# Altium schematic sheet 0255_GPU V1P8A POWER SW.SchDoc
size 848 x 558 mm
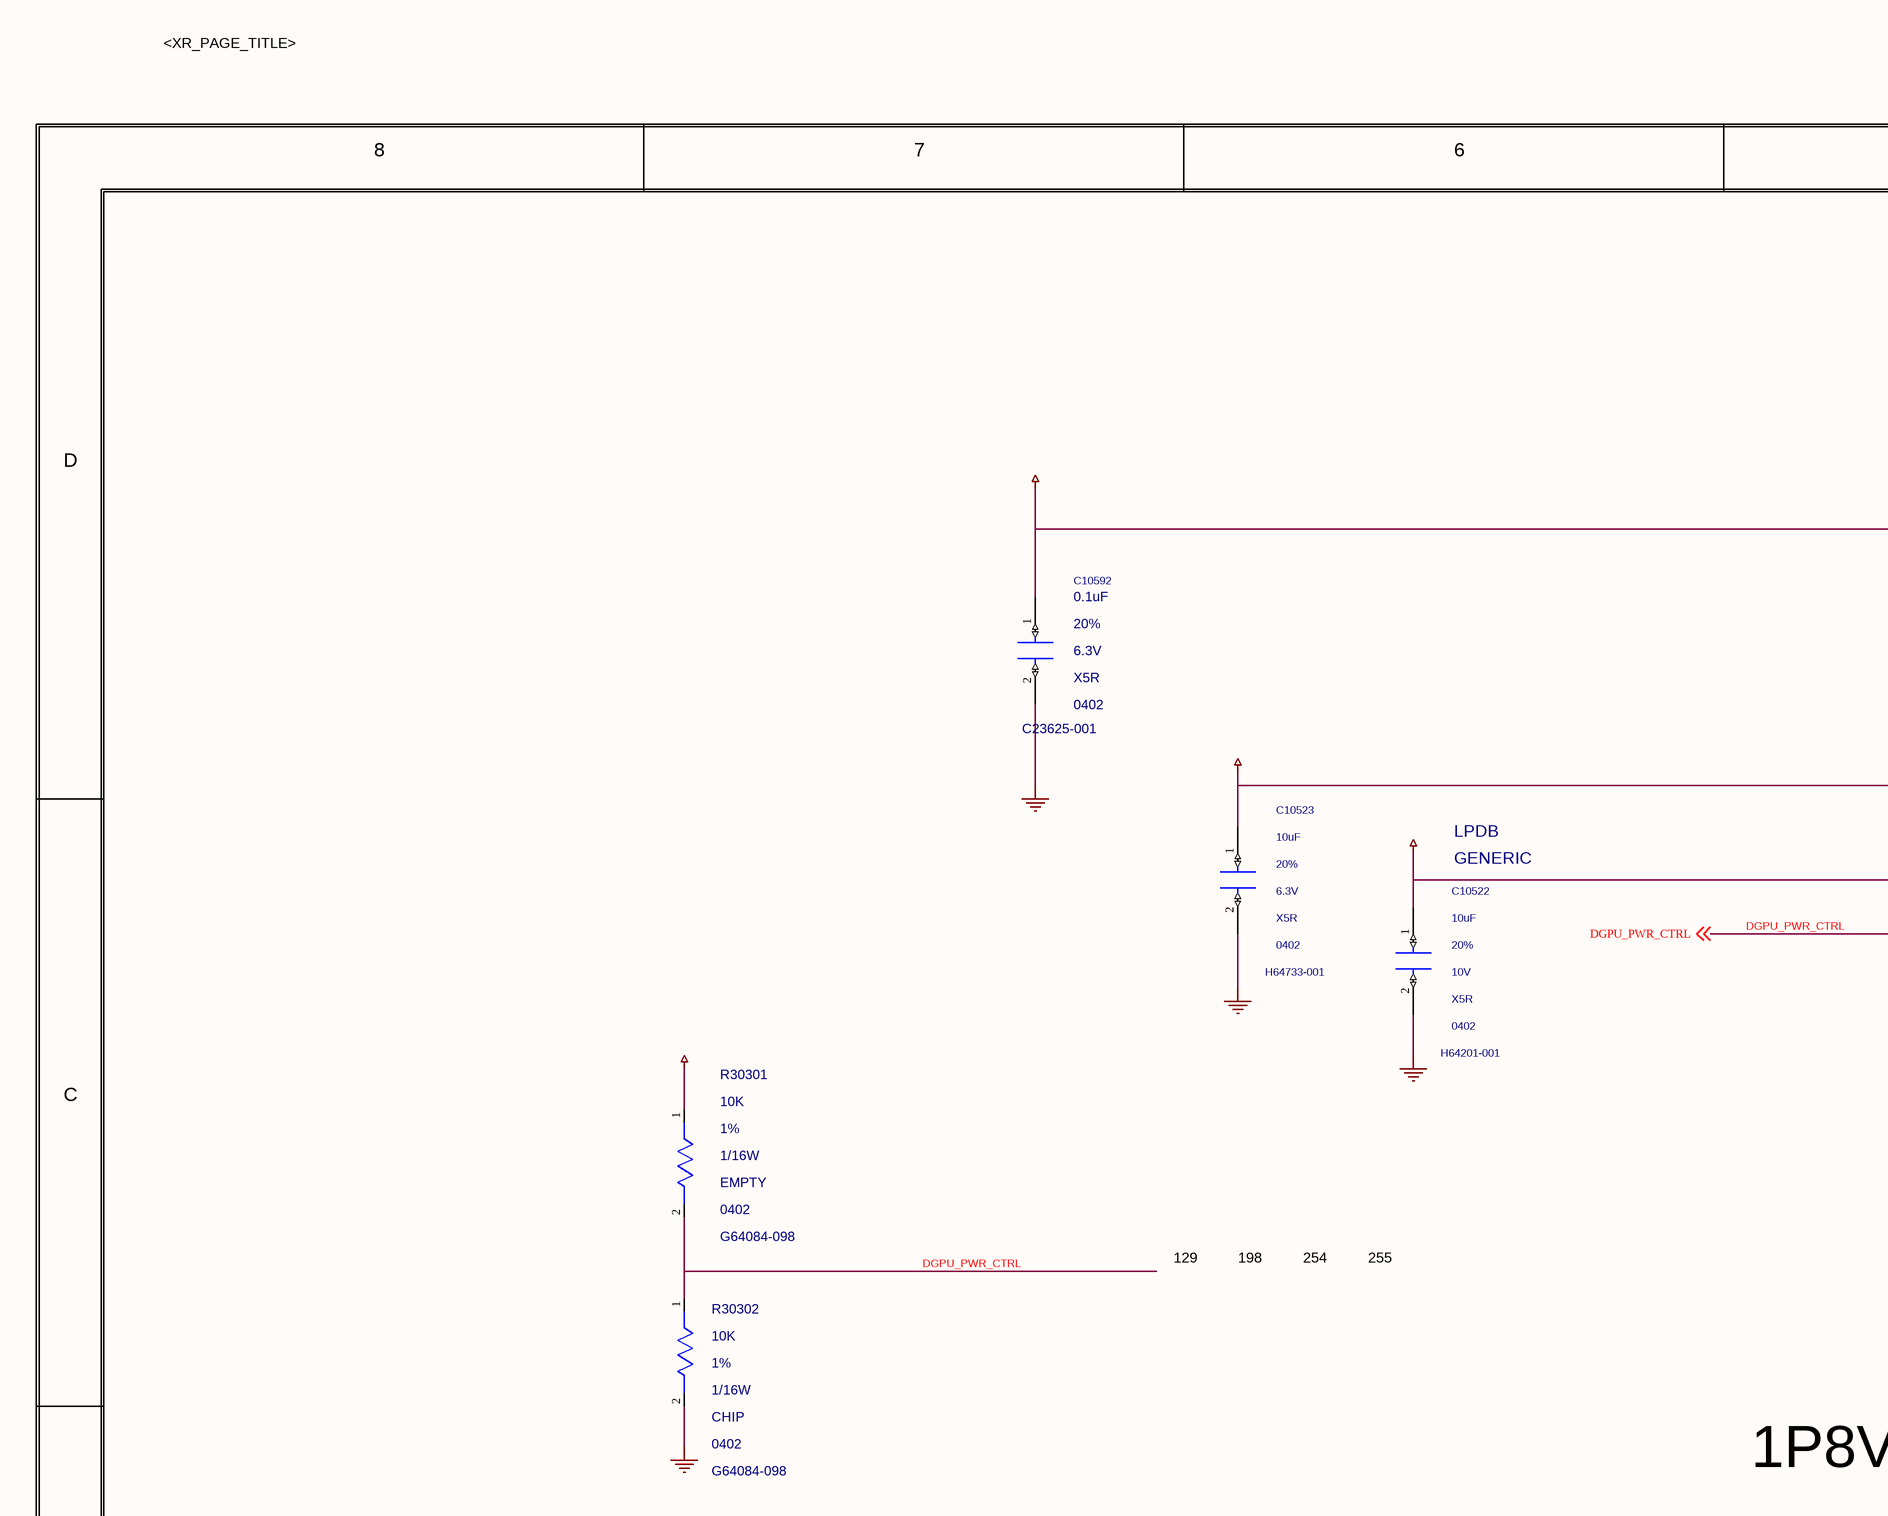
[diagram p0: 0255_GPU V1P8A POWER SW.SchDoc, top left]
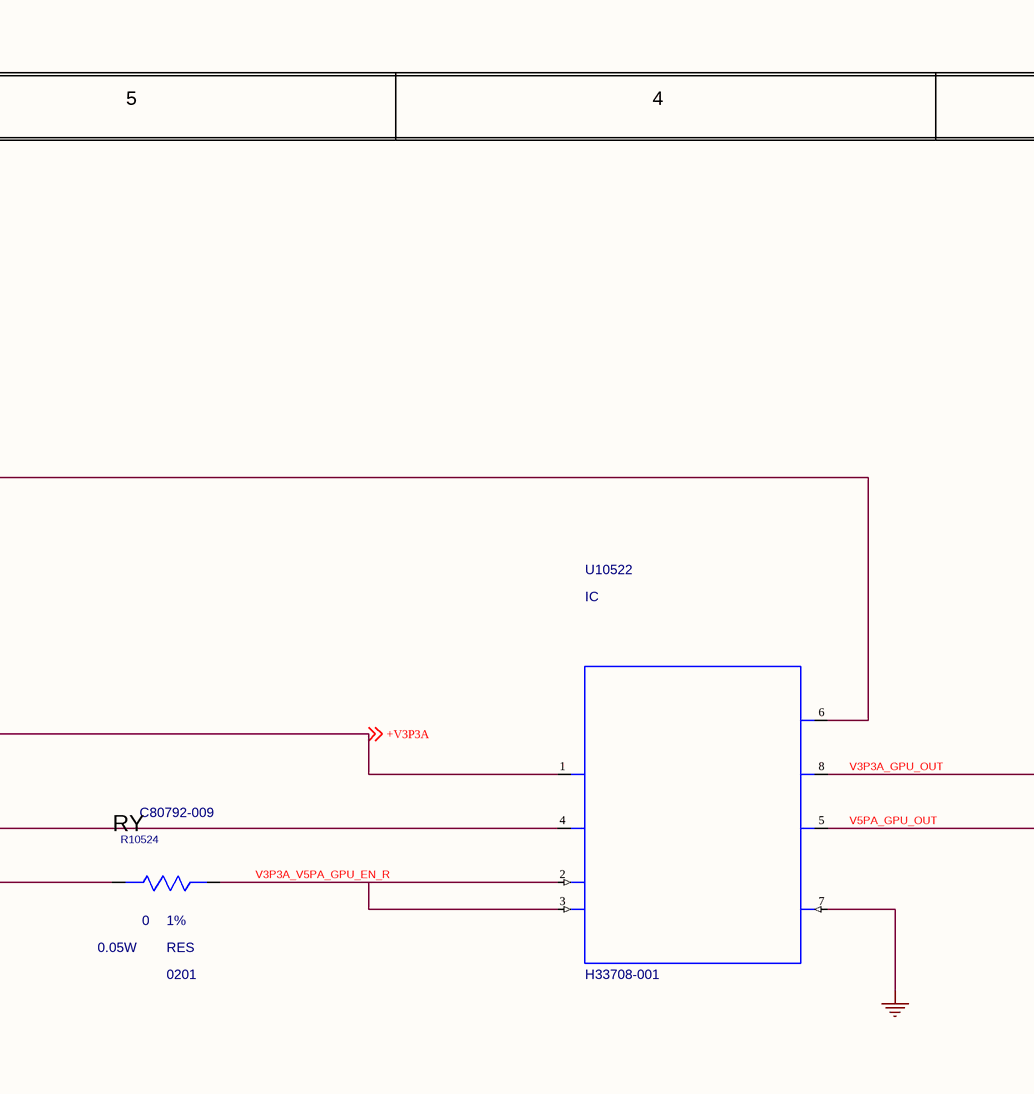
[diagram p1: 0255_GPU V1P8A POWER SW.SchDoc, top middle]
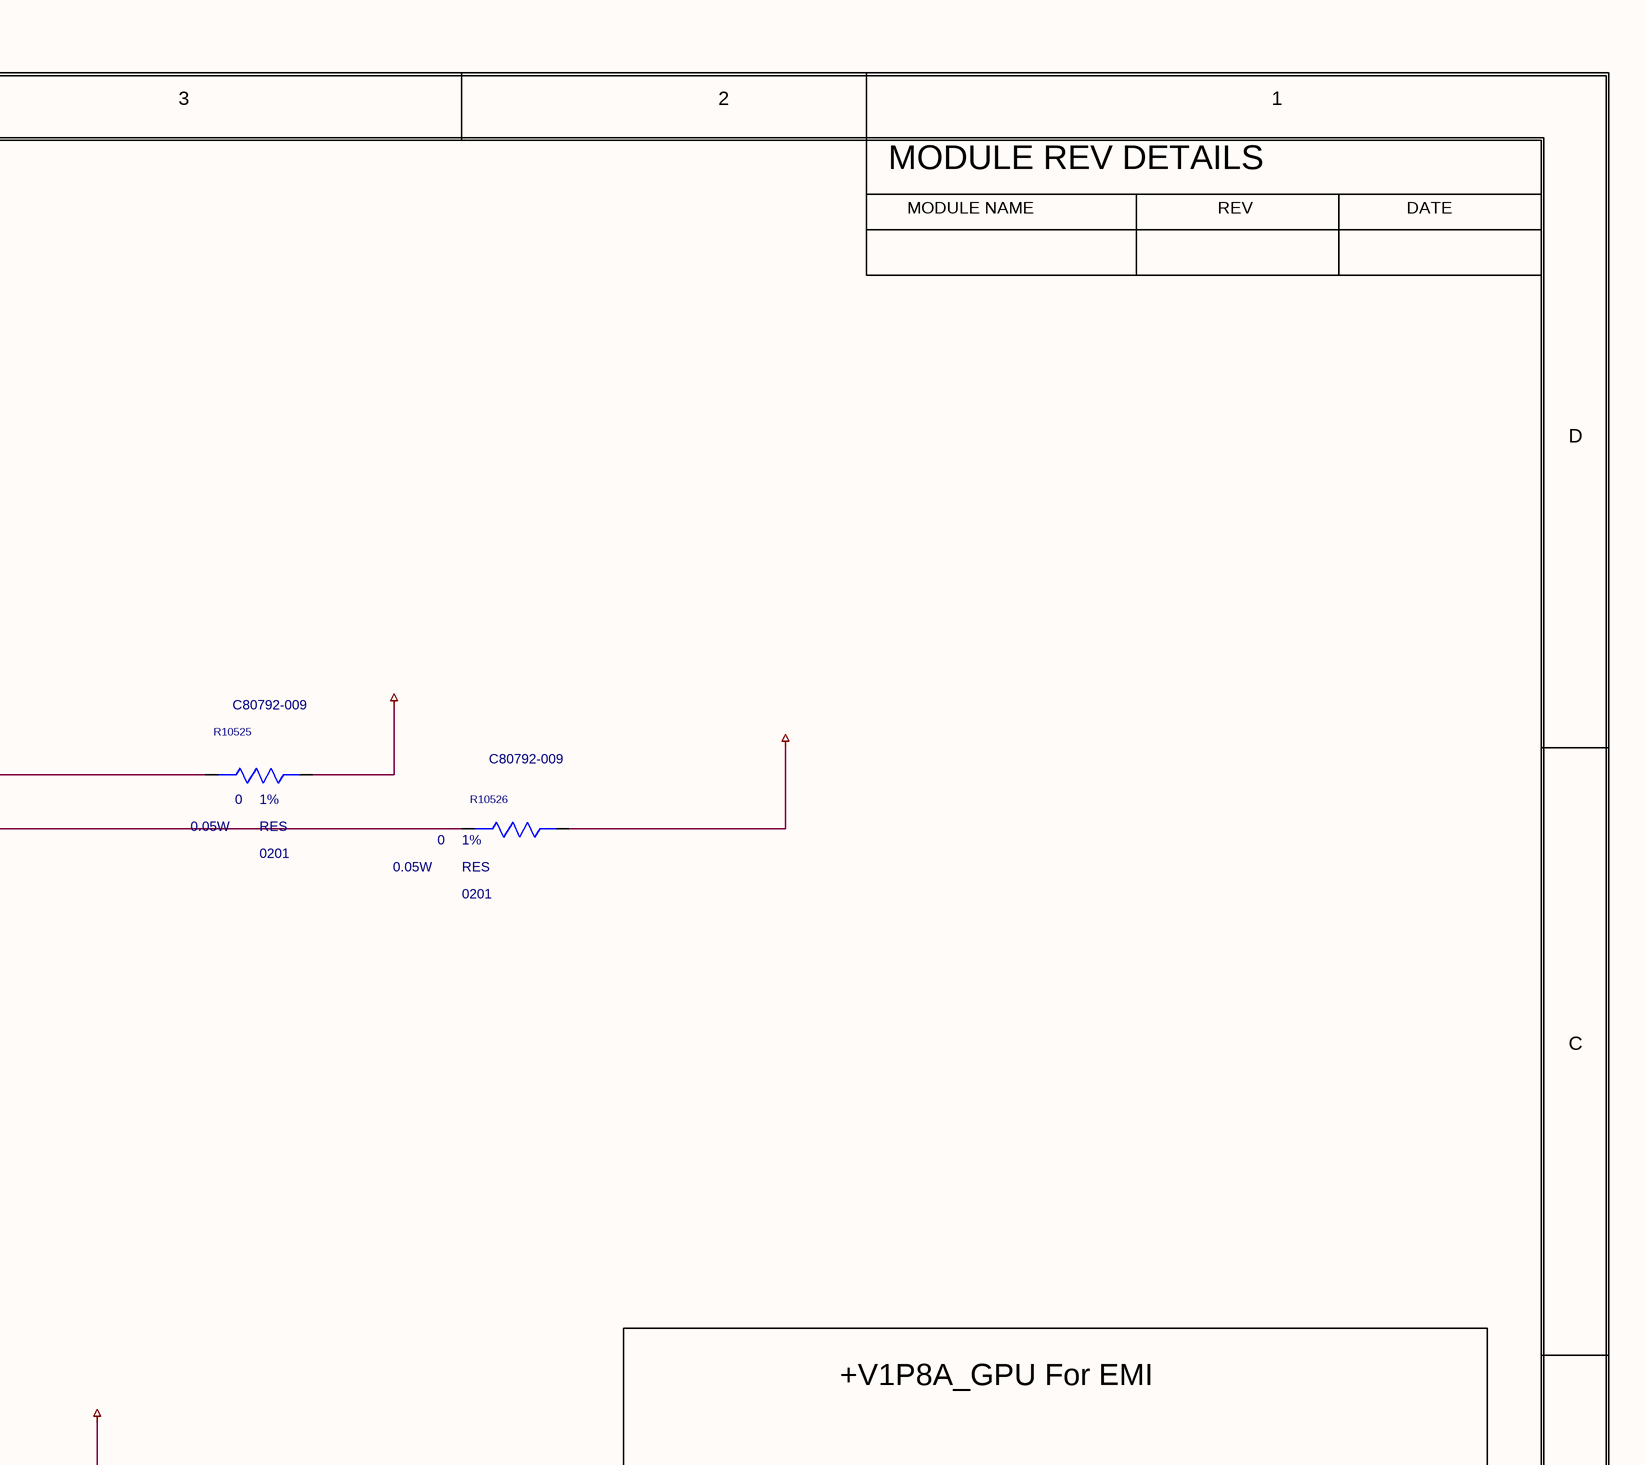
[diagram p2: 0255_GPU V1P8A POWER SW.SchDoc, top right]
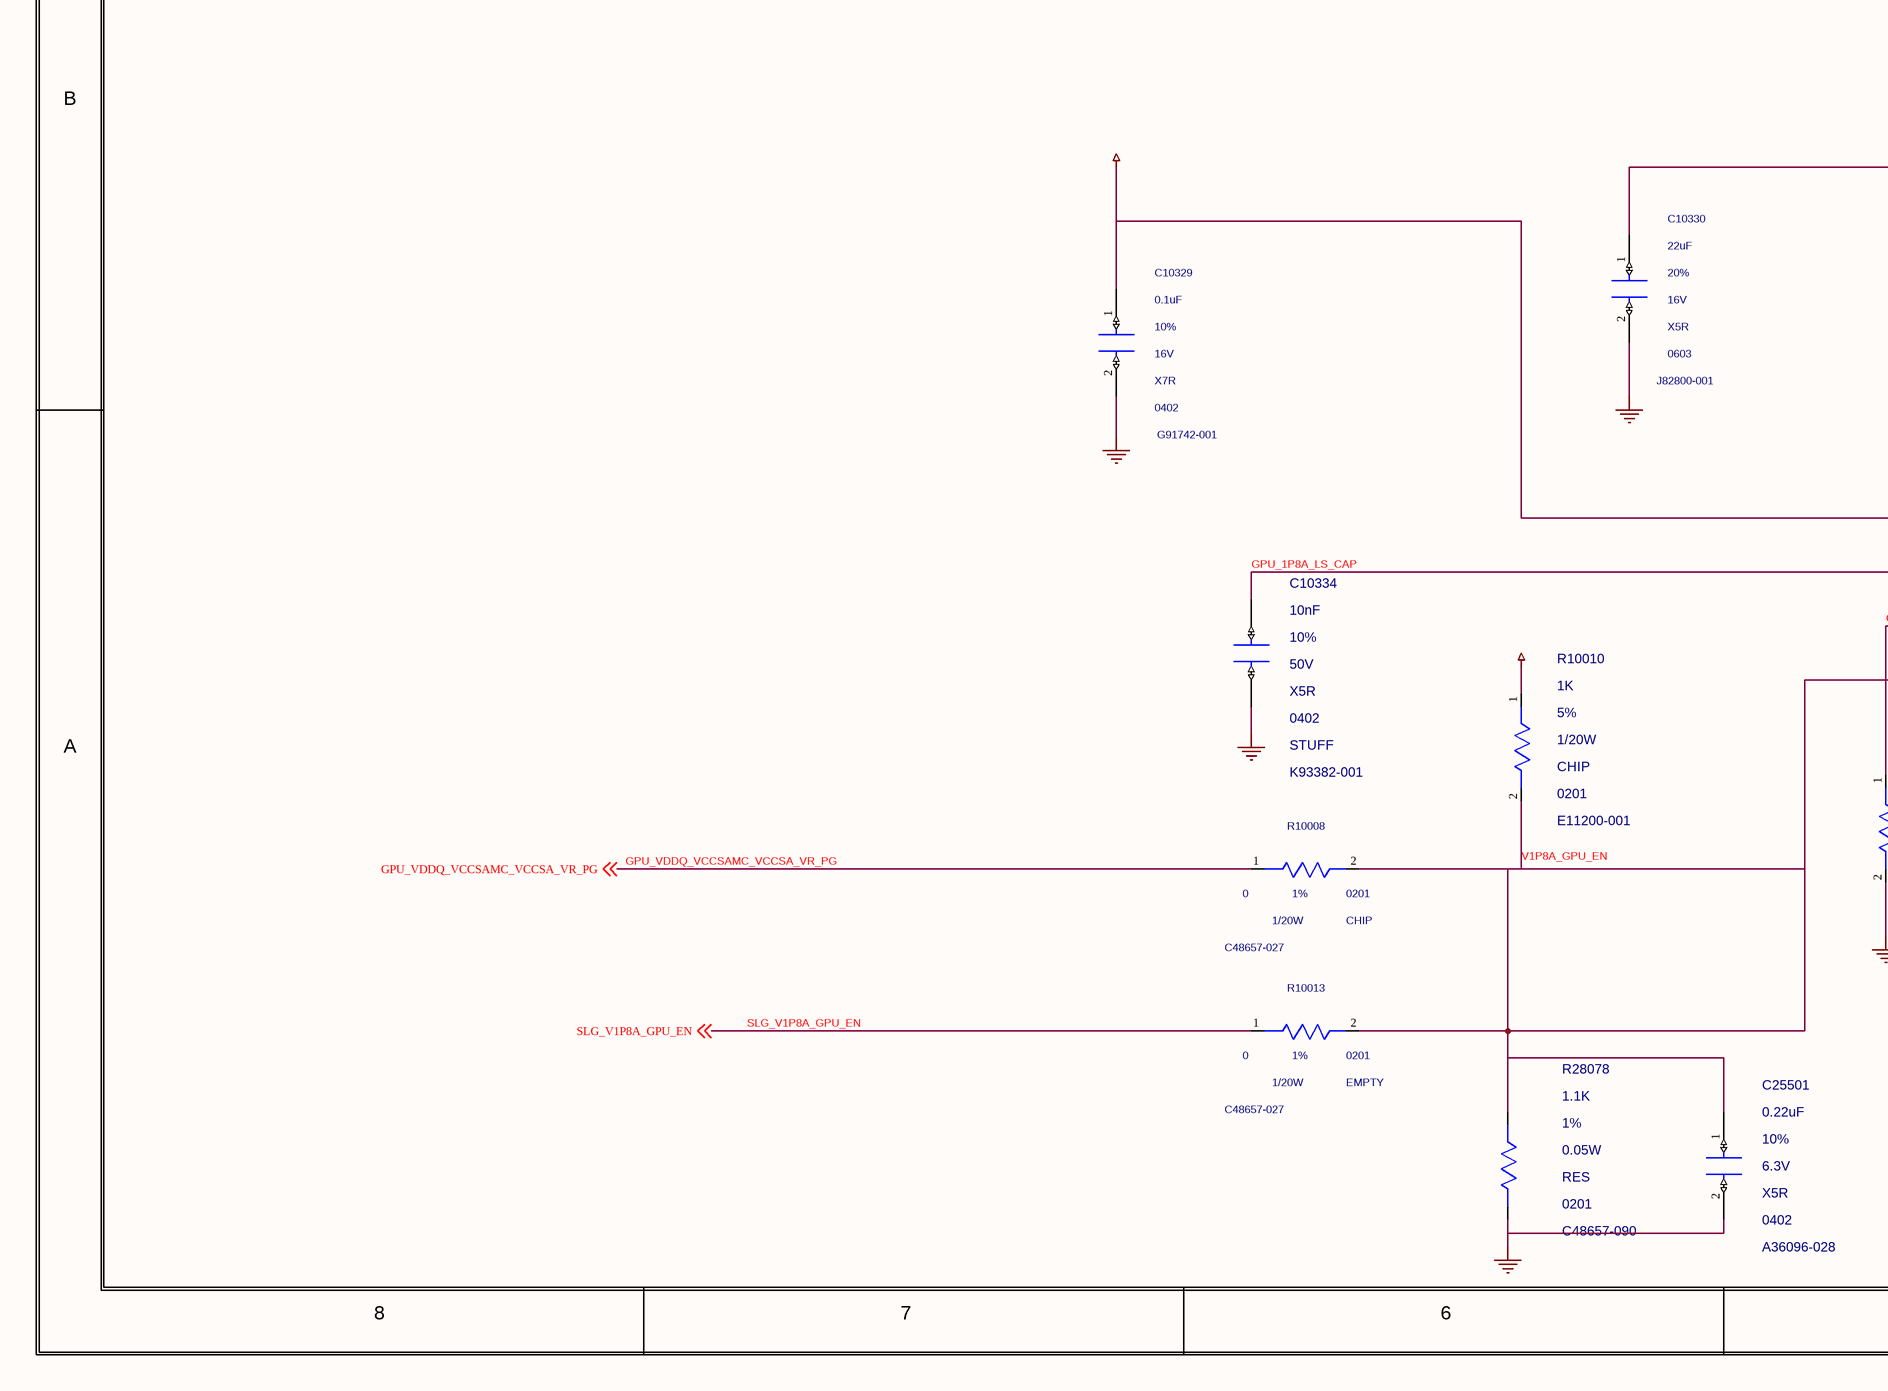
[diagram p3: 0255_GPU V1P8A POWER SW.SchDoc, bottom left]
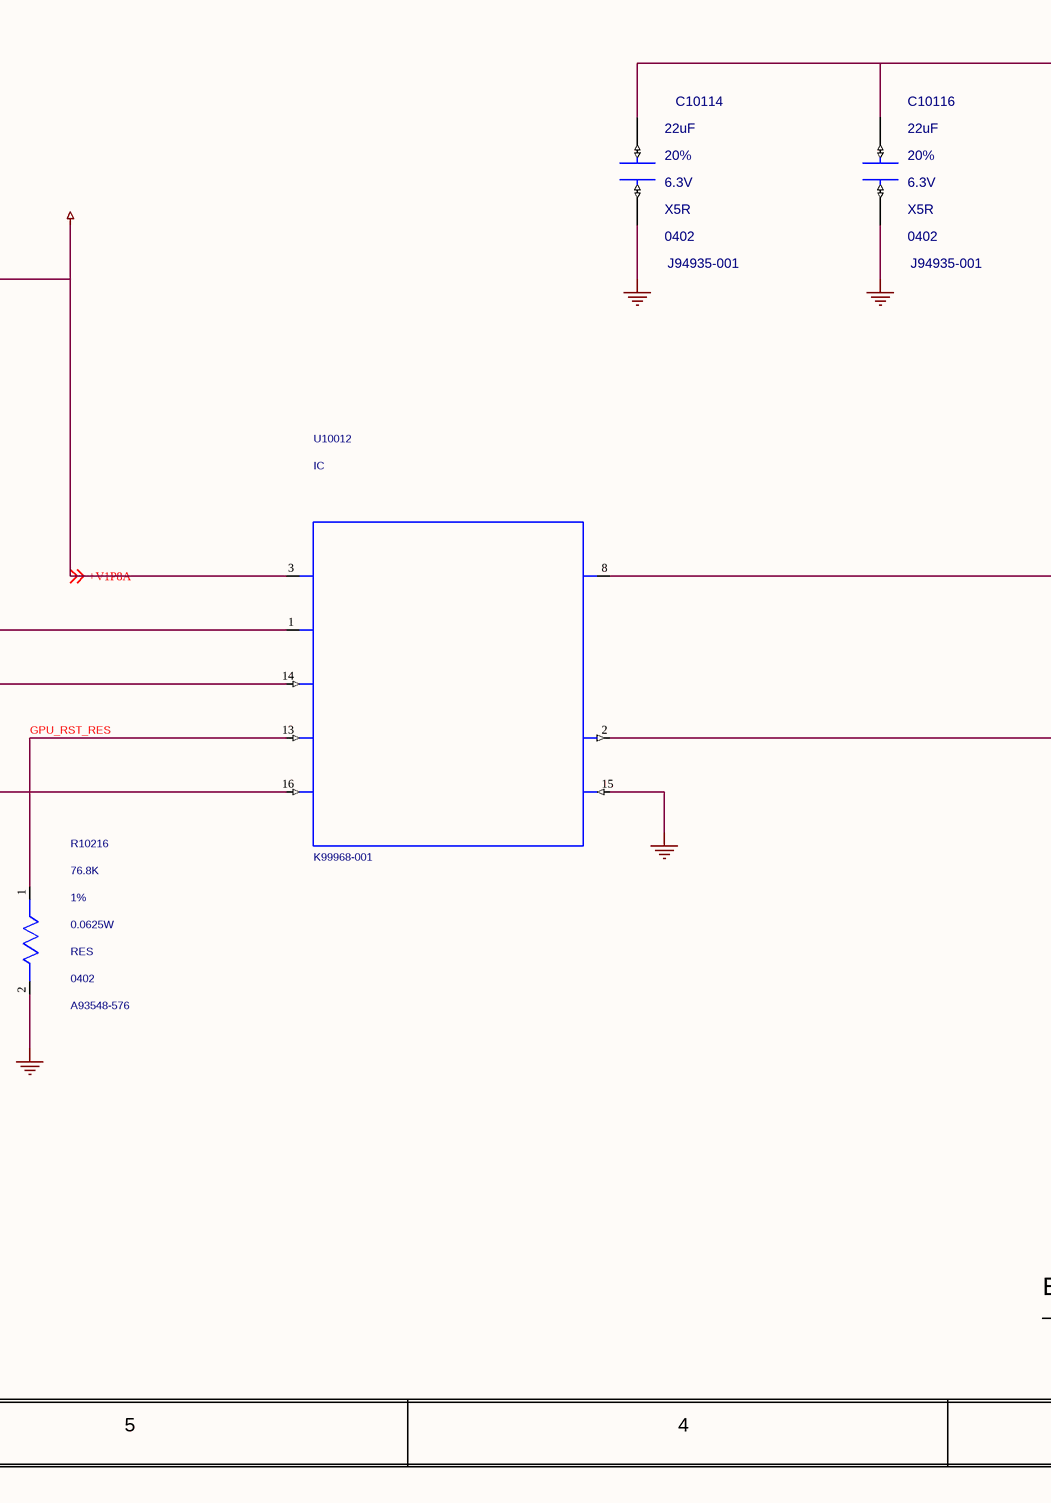
[diagram p4: 0255_GPU V1P8A POWER SW.SchDoc, bottom middle]
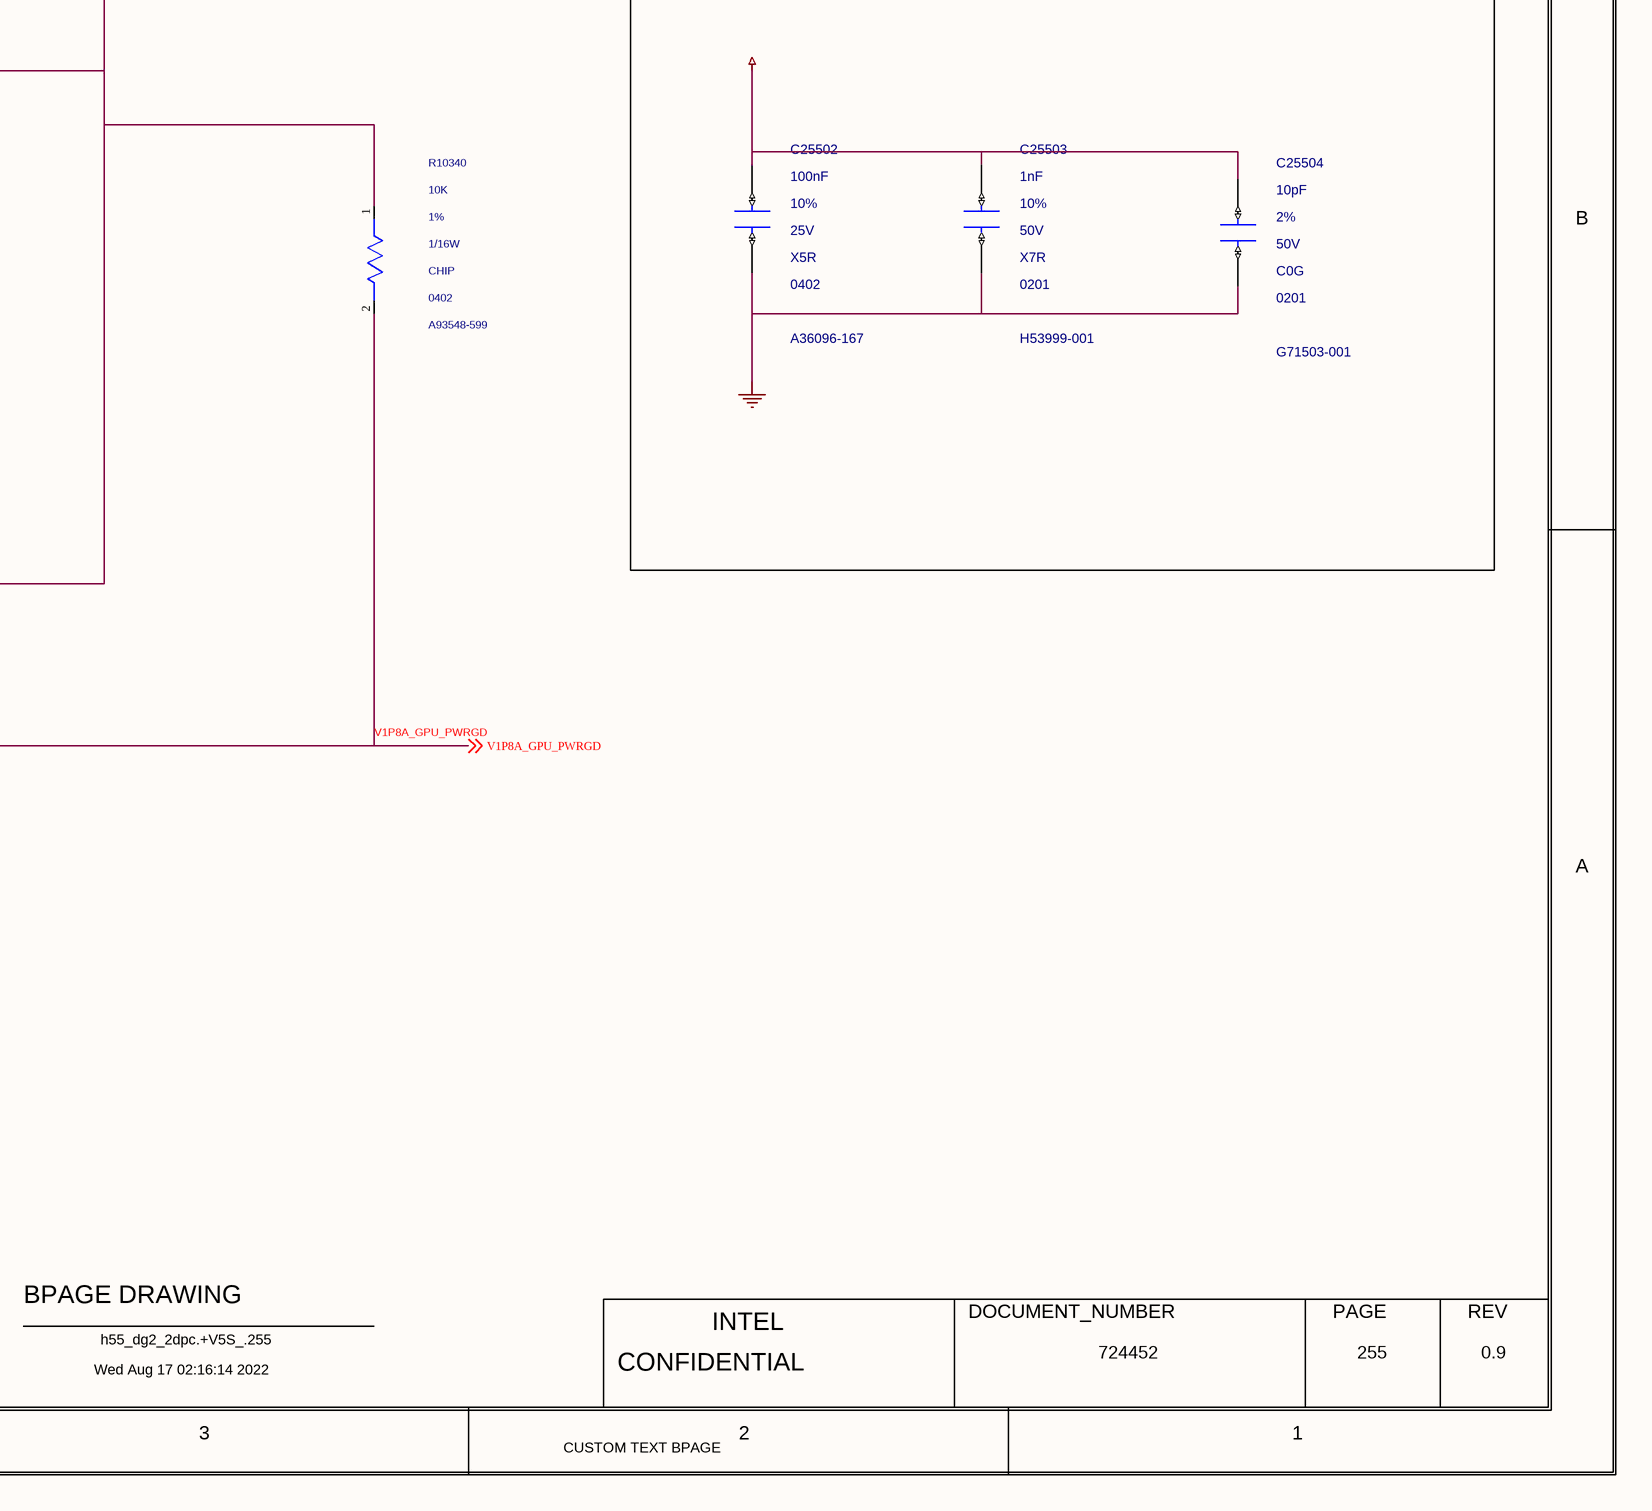
[diagram p5: 0255_GPU V1P8A POWER SW.SchDoc, bottom right]

## Parts
C10114  22uF  MATERIAL: X5R  PACK_TYPE: 0402  PART_NUMBER: J94935-001  TOLERANCE: 20%  VOLTAGE: 6.3V  [CTK2_SM0402_1200X700_MA]
C10116  22uF  MATERIAL: X5R  PACK_TYPE: 0402  PART_NUMBER: J94935-001  TOLERANCE: 20%  VOLTAGE: 6.3V  [CTK2_SM0402_1200X700_MA]
C10329  0.1uF  MATERIAL: X7R  PACK_TYPE: 0402  PART_NUMBER: G91742-001  TOLERANCE: 10%  VOLTAGE: 16V  [SMC0402IA]
C10330  22uF  MATERIAL: X5R  PACK_TYPE: 0603  PART_NUMBER: J82800-001  TOLERANCE: 20%  VOLTAGE: 16V  [SMC1608MG]
C10334  10nF  BOM_USE: STUFF  MATERIAL: X5R  PACK_TYPE: 0402  PART_NUMBER: K93382-001  TOLERANCE: 10%  VOLTAGE: 50V  [TK0_SM0402_1050X550_MO]
C10522  10uF  MATERIAL: X5R  PACK_TYPE: 0402  PART_NUMBER: H64201-001  TOLERANCE: 20%  VOLTAGE: 10V  IP: GENERIC  FP_TECH: LPDB  [SMC0402ID]
C10523  10uF  MATERIAL: X5R  PACK_TYPE: 0402  PART_NUMBER: H64733-001  TOLERANCE: 20%  VOLTAGE: 6.3V  [SMC1005MB]
C10592  0.1uF  MATERIAL: X5R  PACK_TYPE: 0402  PART_NUMBER: C23625-001  TOLERANCE: 20%  VOLTAGE: 6.3V  [SMC0402IA]
C25501  0.22uF  MATERIAL: X5R  PACK_TYPE: 0402  PART_NUMBER: A36096-028  TOLERANCE: 10%  VOLTAGE: 6.3V  [SMC0402IA]
C25502  100nF  MATERIAL: X5R  PACK_TYPE: 0402  PART_NUMBER: A36096-167  TOLERANCE: 10%  VOLTAGE: 25V  [CTK2_SM0402_1050X550_MA]
C25503  1nF  MATERIAL: X7R  PACK_TYPE: 0201  PART_NUMBER: H53999-001  TOLERANCE: 10%  VOLTAGE: 50V  [CTK2_SM0201_630X330_MA]
C25504  10pF  MATERIAL: C0G  PACK_TYPE: 0201  PART_NUMBER: G71503-001  TOLERANCE: 2%  VOLTAGE: 50V  [CTK2_SM0201_630X330_MA]
R10008  0  MATERIAL: CHIP  PACK_TYPE: 0201  PART_NUMBER: C48657-027  TOLERANCE: 1%  WATTAGE: 1/20W  [SMR0201IA]
R10010  1K  MATERIAL: CHIP  PACK_TYPE: 0201  PART_NUMBER: E11200-001  TOLERANCE: 5%  WATTAGE: 1/20W  [SMR0201IA]
R10013  0  MATERIAL: EMPTY  PACK_TYPE: 0201  PART_NUMBER: C48657-027  TOLERANCE: 1%  WATTAGE: 1/20W  [SMR0201IA]
R10216  76.8K  PACK_TYPE: 0402  PART_NUMBER: A93548-576  TOLERANCE: 1%  WATTAGE: 0.0625W  [SMR1005MD]
R10340  10K  MATERIAL: CHIP  PACK_TYPE: 0402  PART_NUMBER: A93548-599  TOLERANCE: 1%  WATTAGE: 1/16W  [SMR0402IA]
R10524  0  MATERIAL: RES  PACK_TYPE: 0201  PART_NUMBER: C80792-009  TOLERANCE: 1%  WATTAGE: 0.05W  [TK0_SM0201_630X330_MC]
R10525  0  MATERIAL: RES  PACK_TYPE: 0201  PART_NUMBER: C80792-009  TOLERANCE: 1%  WATTAGE: 0.05W  [TK0_SM0201_630X330_MC]
R10526  0  MATERIAL: RES  PACK_TYPE: 0201  PART_NUMBER: C80792-009  TOLERANCE: 1%  WATTAGE: 0.05W  [TK0_SM0201_630X330_MC]
R28078  1.1K  MATERIAL: RES  PACK_TYPE: 0201  PART_NUMBER: C48657-090  TOLERANCE: 1%  WATTAGE: 0.05W  [CTK2_SM0201_630X330_MA]
R30301  10K  MATERIAL: EMPTY  PACK_TYPE: 0402  PART_NUMBER: G64084-098  TOLERANCE: 1%  WATTAGE: 1/16W  [SMR0402IA]
R30302  10K  MATERIAL: CHIP  PACK_TYPE: 0402  PART_NUMBER: G64084-098  TOLERANCE: 1%  WATTAGE: 1/16W  [SMR0402IA]
U10012  MATERIAL: IC  PART_NUMBER: K99968-001  [CTK1_LCC16_1650X2550_400_DF2P_MA_VR]  (hidden comment: C_SLG5NT1703V)
U10522  MATERIAL: IC  PART_NUMBER: H33708-001  [CTK2_LCC8_1050X1650_400_MB]  (hidden comment: C_SLG5NT1462V)

## Blocks framed on the sheet
+V1P8A_GPU For EMI: C25502-C25504

## Nets
+V1P8A: C10330.1(A) U10012.3(VIN) ; off-sheet +V1P8A
+V1P8S_GPU: C10114.1(A) C10116.1(A) C25502.1(A) C25503.1(A) C25504.1(A) R10340.1(A) U10012.8(VOUT)
+V3P3A: C10329.1(A) C10523.1(A) R30301.1(A) U10012.1(VDD) U10522.1(D2) ; off-sheet +V3P3A
+V3P3S_GPU: R10010.1(A) R10525.2(B)
+V5A_L: C10522.1(A) C10592.1(A) U10522.4(D1) U10522.6(VDD)
+V5S_GPU: R10526.2(B)
GND: C10114.2(B) C10116.2(B) C10329.2(B) C10330.2(B) C10334.2(B) C10522.2(B) C10523.2(B) C10592.2(B) C25501.2(B) C25502.2(B) C25503.2(B) C25504.2(B) R10216.2(B) R28078.2(B) R30302.2(B) U10012.15(GND) U10522.7(GND)
DGPU_PWR_CTRL: R10524.1(A) R30301.2(B) R30302.1(A) ; off-sheet DGPU_PWR_CTRL
GPU_1P8A_LS_CAP: C10334.1(A) U10012.14(CAP)
GPU_RST_RES: R10216.1(A) U10012.13(RESET)
GPU_VDDQ_VCCSAMC_VCCSA_VR_PG: R10008.1(A) ; off-sheet GPU_VDDQ_VCCSAMC_VCCSA_VR_PG
SLG_V1P8A_GPU_EN: R10013.1(A) ; off-sheet SLG_V1P8A_GPU_EN
V1P8A_GPU_EN: C25501.1(A) R10008.2(B) R10010.2(B) R10013.2(B) R28078.1(A) U10012.16(ON)
V1P8A_GPU_PWRGD: R10340.2(B) U10012.2(PG) ; off-sheet V1P8A_GPU_PWRGD
V3P3A_GPU_OUT: R10525.1(A) U10522.8(S2)
V3P3A_V5PA_GPU_EN_R: R10524.2(B) U10522.2(ON2) U10522.3(ON1)
V5PA_GPU_OUT: R10526.1(A) U10522.5(S1)

## Notes on the sheet
- <XR_PAGE_TITLE>
- 8
- 7
- 6
- 5
- 4
- 3
- 2
- 1
- MODULE REV DETAILS
- MODULE NAME
- REV
- DATE
- D
- (near R10524) RY
- C
- 129
- 198
- 254
- 255
- 1P8VA POWER GATE
- B
- A
- BPAGE DRAWING
- INTEL
- DOCUMENT_NUMBER
- PAGE
- Wed Aug 17 02:16:14 2022
- h55_dg2_2dpc.+V5S_.255
- CONFIDENTIAL
- 724452
- 0.9
- CUSTOM TEXT BPAGE

## Library data of the parts
C10114 = C_CAP: CDS_PHYS_PART_NAME: C_CAP_0402-J94935-001,X5R,22UF,6.3V,20%,TK2,GENERIC; CDS_LMAN_SYM_OUTLINE: -50,50,50,-50; FP_TECH: TK2; IP: GENERIC; ROOM: NONE; OriginalSymbolOrigin: (-50,25); XY: (625,1900); VER: 1; ROT: 0; PHYS_PAGE: 255; LOCATION: C10114; DRAWING: @RVP1_ADL_SB_ADP_S_DDR5_SODIMM_2DPC_LIB.H55_DG2_2DPC(SCH_1):PAGE367; CDS_LIB: c_discrete; VARIANT: ?; PCB Footprint: CTK2_SM0402_1200X700_MA; CHIPS_PART_NAME: C_CAP; CDS_PART_NAME: C_CAP_0402-J94935-001,X5R,22UF,6.3V,20%,TK2,GENERIC; CDS_LOCATION: C10114
C10116 = C_CAP: CDS_PHYS_PART_NAME: C_CAP_0402-J94935-001,X5R,22UF,6.3V,20%,TK2,GENERIC; CDS_LMAN_SYM_OUTLINE: -50,50,50,-50; FP_TECH: TK2; IP: GENERIC; ROOM: NONE; OriginalSymbolOrigin: (-50,25); XY: (1075,1900); VER: 1; ROT: 0; PHYS_PAGE: 255; LOCATION: C10116; DRAWING: @RVP1_ADL_SB_ADP_S_DDR5_SODIMM_2DPC_LIB.H55_DG2_2DPC(SCH_1):PAGE367; CDS_LIB: c_discrete; VARIANT: ?; PCB Footprint: CTK2_SM0402_1200X700_MA; CHIPS_PART_NAME: C_CAP; CDS_PART_NAME: C_CAP_0402-J94935-001,X5R,22UF,6.3V,20%,TK2,GENERIC; CDS_LOCATION: C10116
C10329 = CAP: CDS_PHYS_PART_NAME: CAP_0402-G91742-001,X7R,0.1UF,16V,10%,LPDB,GENERIC; OriginalSymbolOrigin: (-50,25); XY: (-1925,1375); VER: 1; ROT: 0; PHYS_PAGE: 255; LOCATION: C10329; DRAWING: @RVP1_ADL_SB_ADP_S_DDR5_SODIMM_2DPC_LIB.H55_DG2_2DPC(SCH_1):PAGE367; CDS_LIB: discrete; PCB Footprint: SMC0402IA; CHIPS_PART_NAME: CAP; CDS_PART_NAME: CAP_0402-G91742-001,X7R,0.1UF,16V,10%,LPDB,GENERIC; CDS_LOCATION: C10329
C10330 = CAP: CDS_PHYS_PART_NAME: CAP_0603-J82800-001,X5R,22UF,16V,20%,LPDB,GENERIC; OriginalSymbolOrigin: (-50,25); XY: (-975,1475); VER: 1; ROT: 0; PHYS_PAGE: 255; LOCATION: C10330; DRAWING: @RVP1_ADL_SB_ADP_S_DDR5_SODIMM_2DPC_LIB.H55_DG2_2DPC(SCH_1):PAGE367; CDS_LIB: discrete; PCB Footprint: SMC1608MG; CHIPS_PART_NAME: CAP; CDS_PART_NAME: CAP_0603-J82800-001,X5R,22UF,16V,20%,LPDB,GENERIC; CDS_LOCATION: C10330
C10334 = CAP_2: CDS_PHYS_PART_NAME: CAP_2_0402-K93382-001,X5R,10NF,50V,10%,TK0,GENERIC; CDS_LMAN_SYM_OUTLINE: -50,50,50,-50; FP_TECH: TK0; IP: GENERIC; ROOM: NONE; OriginalSymbolOrigin: (-50,25); XY: (-1675,800); VER: 1; ROT: 0; PHYS_PAGE: 255; LOCATION: C10334; DRAWING: @RVP1_ADL_SB_ADP_S_DDR5_SODIMM_2DPC_LIB.H55_DG2_2DPC(SCH_1):PAGE367; CDS_LIB: discrete_2; VARIANT: ?; PCB Footprint: TK0_SM0402_1050X550_MO; CHIPS_PART_NAME: CAP_2; CDS_PART_NAME: CAP_2_0402-K93382-001,X5R,10NF,50V,10%,TK0,GENERIC; CDS_LOCATION: C10334
C10522 = CAP: CDS_PHYS_PART_NAME: CAP_0402-H64201-001,X5R,10UF,10V,20%,LPDB,GENERIC; OriginalSymbolOrigin: (-50,25); XY: (-1375,3200); VER: 1; ROT: 0; PHYS_PAGE: 255; LOCATION: C10522; DRAWING: @RVP1_ADL_SB_ADP_S_DDR5_SODIMM_2DPC_LIB.H55_DG2_2DPC(SCH_1):PAGE367; CDS_LIB: discrete; PCB Footprint: SMC0402ID; CHIPS_PART_NAME: CAP; CDS_PART_NAME: CAP_0402-H64201-001,X5R,10UF,10V,20%,LPDB,GENERIC; CDS_LOCATION: C10522
C10523 = CAP: CDS_PHYS_PART_NAME: CAP_0402-H64733-001,X5R,10UF,6.3V,20%,LPDB,GENERIC; OriginalSymbolOrigin: (-50,25); XY: (-1700,3350); VER: 1; ROT: 0; PHYS_PAGE: 255; LOCATION: C10523; DRAWING: @RVP1_ADL_SB_ADP_S_DDR5_SODIMM_2DPC_LIB.H55_DG2_2DPC(SCH_1):PAGE367; CDS_LIB: discrete; PCB Footprint: SMC1005MB; CHIPS_PART_NAME: CAP; CDS_PART_NAME: CAP_0402-H64733-001,X5R,10UF,6.3V,20%,LPDB,GENERIC; CDS_LOCATION: C10523
C10592 = CAP: CDS_PHYS_PART_NAME: CAP_0402-C23625-001,X5R,0.1UF,6.3V,20%,LPDB,GENERIC; OriginalSymbolOrigin: (-50,25); XY: (-2075,3775); VER: 1; ROT: 0; PHYS_PAGE: 255; LOCATION: C10592; IP: GENERIC; FP_TECH: LPDB; DRAWING: @RVP1_ADL_SB_ADP_S_DDR5_SODIMM_2DPC_LIB.H55_DG2_2DPC(SCH_1):PAGE367; CDS_LIB: discrete; PCB Footprint: SMC0402IA; CHIPS_PART_NAME: CAP; CDS_PART_NAME: CAP_0402-C23625-001,X5R,0.1UF,6.3V,20%,LPDB,GENERIC; CDS_LOCATION: C10592
C25501 = CAP: CDS_PHYS_PART_NAME: CAP_0402-A36096-028,X5R,0.22UF,6.3V,10%,LPDB,GENERIC; OriginalSymbolOrigin: (-50,25); XY: (-800,-150); VER: 1; ROT: 0; PHYS_PAGE: 255; LOCATION: C25501; IP: GENERIC; FP_TECH: LPDB; DRAWING: @RVP1_ADL_SB_ADP_S_DDR5_SODIMM_2DPC_LIB.H55_DG2_2DPC(SCH_1):PAGE367; CDS_LIB: discrete; PCB Footprint: SMC0402IA; CHIPS_PART_NAME: CAP; CDS_PART_NAME: CAP_0402-A36096-028,X5R,0.22UF,6.3V,10%,LPDB,GENERIC; CDS_LOCATION: C25501
C25502 = C_CAP: CDS_PHYS_PART_NAME: C_CAP_0402-A36096-167,X5R,100NF,25V,10%,TK2,GENERIC; CDS_LMAN_SYM_OUTLINE: -50,50,50,-50; FP_TECH: TK2; IP: GENERIC; ROOM: NONE; OriginalSymbolOrigin: (-50,25); XY: (2725,1825); VER: 1; ROT: 0; PHYS_PAGE: 255; LOCATION: C25502; DRAWING: @RVP1_ADL_SB_ADP_S_DDR5_SODIMM_2DPC_LIB.H55_DG2_2DPC(SCH_1):PAGE367; CDS_LIB: c_discrete; VARIANT: ?; PCB Footprint: CTK2_SM0402_1050X550_MA; CHIPS_PART_NAME: C_CAP; CDS_PART_NAME: C_CAP_0402-A36096-167,X5R,100NF,25V,10%,TK2,GENERIC; CDS_LOCATION: C25502
C25503 = C_CAP: CDS_PHYS_PART_NAME: C_CAP_0201-H53999-001,X7R,1NF,50V,10%,TK2,GENERIC; CDS_LMAN_SYM_OUTLINE: -50,50,50,-50; FP_TECH: TK2; IP: GENERIC; ROOM: NONE; OriginalSymbolOrigin: (-50,25); XY: (3150,1825); VER: 1; ROT: 0; PHYS_PAGE: 255; LOCATION: C25503; DRAWING: @RVP1_ADL_SB_ADP_S_DDR5_SODIMM_2DPC_LIB.H55_DG2_2DPC(SCH_1):PAGE367; CDS_LIB: c_discrete; VARIANT: ?; PCB Footprint: CTK2_SM0201_630X330_MA; CHIPS_PART_NAME: C_CAP; CDS_PART_NAME: C_CAP_0201-H53999-001,X7R,1NF,50V,10%,TK2,GENERIC; CDS_LOCATION: C25503
C25504 = C_CAP: CDS_PHYS_PART_NAME: C_CAP_0201-G71503-001,C0G,10PF,50V,2%,TK2,GENERIC; CDS_LMAN_SYM_OUTLINE: -50,50,50,-50; FP_TECH: TK2; IP: GENERIC; ROOM: NONE; OriginalSymbolOrigin: (-50,25); XY: (3625,1800); VER: 1; ROT: 0; PHYS_PAGE: 255; LOCATION: C25504; DRAWING: @RVP1_ADL_SB_ADP_S_DDR5_SODIMM_2DPC_LIB.H55_DG2_2DPC(SCH_1):PAGE367; CDS_LIB: c_discrete; VARIANT: ?; PCB Footprint: CTK2_SM0201_630X330_MA; CHIPS_PART_NAME: C_CAP; CDS_PART_NAME: C_CAP_0201-G71503-001,C0G,10PF,50V,2%,TK2,GENERIC; CDS_LOCATION: C25504
R10008 = RES#1: CHIPS_PART_NAME: RES; CDS_PHYS_PART_NAME: RES_0201-C48657-027,CHIP,0,1%,1/20W,LPDB,GENERIC; OriginalSymbolOrigin: (-75,25); XY: (-1575,400); VER: 1; PHYS_PAGE: 255; LOCATION: R10008; DRAWING: @RVP1_ADL_SB_ADP_S_DDR5_SODIMM_2DPC_LIB.H55_DG2_2DPC(SCH_1):PAGE367; CDS_LIB: discrete; PCB Footprint: SMR0201IA; ROT: 0; CDS_PART_NAME: RES_0201-C48657-027,CHIP,0,1%,1/20W,LPDB,GENERIC; CDS_LOCATION: R10008
R10010 = RES: CDS_PHYS_PART_NAME: RES_0201-E11200-001,CHIP,1K,5%,1/20W,LPDB,GENERIC; OriginalSymbolOrigin: (-25,75); XY: (-1175,625); VER: 2; ROT: 0; PHYS_PAGE: 255; LOCATION: R10010; IP: GENERIC; FP_TECH: LPDB; DRAWING: @RVP1_ADL_SB_ADP_S_DDR5_SODIMM_2DPC_LIB.H55_DG2_2DPC(SCH_1):PAGE367; CDS_LIB: discrete; PCB Footprint: SMR0201IA; CHIPS_PART_NAME: RES; CDS_PART_NAME: RES_0201-E11200-001,CHIP,1K,5%,1/20W,LPDB,GENERIC; CDS_LOCATION: R10010
R10013 = RES#1: CHIPS_PART_NAME: RES; CDS_PHYS_PART_NAME: RES_0201-C48657-027,EMPTY,0,1%,1/20W,LPDB,GENERIC; OriginalSymbolOrigin: (-75,25); XY: (-1575,100); VER: 1; PHYS_PAGE: 255; LOCATION: R10013; FP_TECH: LPDB; DRAWING: @RVP1_ADL_SB_ADP_S_DDR5_SODIMM_2DPC_LIB.H55_DG2_2DPC(SCH_1):PAGE367; CDS_LIB: discrete; PCB Footprint: SMR0201IA; ROT: 0; CDS_PART_NAME: RES_0201-C48657-027,EMPTY,0,1%,1/20W,LPDB,GENERIC; CDS_LOCATION: R10013
R10216 = RES: CDS_PHYS_PART_NAME: RES_0402-A93548-576,RES,76.8K,1%,0.0625W,LPDB,GENERIC; OriginalSymbolOrigin: (-25,75); XY: (-500,475); VER: 2; ROT: 0; PHYS_PAGE: 255; LOCATION: R10216; DRAWING: @RVP1_ADL_SB_ADP_S_DDR5_SODIMM_2DPC_LIB.H55_DG2_2DPC(SCH_1):PAGE367; CDS_LIB: discrete; MATERIAL: RES; PCB Footprint: SMR1005MD; CHIPS_PART_NAME: RES; CDS_PART_NAME: RES_0402-A93548-576,RES,76.8K,1%,0.0625W,LPDB,GENERIC; CDS_LOCATION: R10216
R10340 = RES: CDS_PHYS_PART_NAME: RES_0402-A93548-599,CHIP,10K,1%,1/16W,LPDB,GENERIC; OriginalSymbolOrigin: (-25,75); XY: (2025,1750); VER: 2; ROT: 0; PHYS_PAGE: 255; LOCATION: R10340; FP_TECH: LPDB; DRAWING: @RVP1_ADL_SB_ADP_S_DDR5_SODIMM_2DPC_LIB.H55_DG2_2DPC(SCH_1):PAGE367; CDS_LIB: discrete; PCB Footprint: SMR0402IA; CHIPS_PART_NAME: RES; CDS_PART_NAME: RES_0402-A93548-599,CHIP,10K,1%,1/16W,LPDB,GENERIC; CDS_LOCATION: R10340
R10524 = RES_2#1: CHIPS_PART_NAME: RES_2; CDS_PHYS_PART_NAME: RES_2_0201-C80792-009,RES,0,1%,0.05W,TK0,GENERIC; BOM_USE: STUFF; CDS_LMAN_SYM_OUTLINE: -50,50,50,-50; FP_TECH: TK0; IP: GENERIC; ROOM: NONE; OriginalSymbolOrigin: (-75,25); XY: (-225,3250); VER: 1; PHYS_PAGE: 255; LOCATION: R10524; DRAWING: @RVP1_ADL_SB_ADP_S_DDR5_SODIMM_2DPC_LIB.H55_DG2_2DPC(SCH_1):PAGE367; CDS_LIB: discrete_2; VARIANT: ?; PCB Footprint: TK0_SM0201_630X330_MC; ROT: 0; CDS_PART_NAME: RES_2_0201-C80792-009,RES,0,1%,0.05W,TK0,GENERIC; CDS_LOCATION: R10524
R10525 = RES_2#1: CHIPS_PART_NAME: RES_2; CDS_PHYS_PART_NAME: RES_2_0201-C80792-009,RES,0,1%,0.05W,TK0,GENERIC; BOM_USE: STUFF; CDS_LMAN_SYM_OUTLINE: -50,50,50,-50; FP_TECH: TK0; IP: GENERIC; ROOM: NONE; OriginalSymbolOrigin: (-75,25); XY: (1825,3450); VER: 1; PHYS_PAGE: 255; LOCATION: R10525; DRAWING: @RVP1_ADL_SB_ADP_S_DDR5_SODIMM_2DPC_LIB.H55_DG2_2DPC(SCH_1):PAGE367; CDS_LIB: discrete_2; VARIANT: ?; PCB Footprint: TK0_SM0201_630X330_MC; ROT: 0; CDS_PART_NAME: RES_2_0201-C80792-009,RES,0,1%,0.05W,TK0,GENERIC; CDS_LOCATION: R10525
R10526 = RES_2#1: CHIPS_PART_NAME: RES_2; CDS_PHYS_PART_NAME: RES_2_0201-C80792-009,RES,0,1%,0.05W,TK0,GENERIC; BOM_USE: STUFF; CDS_LMAN_SYM_OUTLINE: -50,50,50,-50; FP_TECH: TK0; IP: GENERIC; ROOM: NONE; OriginalSymbolOrigin: (-75,25); XY: (2300,3350); VER: 1; PHYS_PAGE: 255; LOCATION: R10526; DRAWING: @RVP1_ADL_SB_ADP_S_DDR5_SODIMM_2DPC_LIB.H55_DG2_2DPC(SCH_1):PAGE367; CDS_LIB: discrete_2; VARIANT: ?; PCB Footprint: TK0_SM0201_630X330_MC; ROT: 0; CDS_PART_NAME: RES_2_0201-C80792-009,RES,0,1%,0.05W,TK0,GENERIC; CDS_LOCATION: R10526
R28078 = C_RES: CDS_PHYS_PART_NAME: C_RES_0201-C48657-090,RES,1.1K,1%,0.05W,TK2,GENERIC; CDS_LMAN_SYM_OUTLINE: -50,50,50,-50; FP_TECH: TK2; IP: GENERIC; ROOM: NONE; OriginalSymbolOrigin: (-25,75); XY: (-1200,-150); VER: 2; ROT: 0; PHYS_PAGE: 255; LOCATION: R28078; DRAWING: @RVP1_ADL_SB_ADP_S_DDR5_SODIMM_2DPC_LIB.H55_DG2_2DPC(SCH_1):PAGE367; CDS_LIB: c_discrete; VARIANT: ?; PCB Footprint: CTK2_SM0201_630X330_MA; CHIPS_PART_NAME: C_RES; CDS_PART_NAME: C_RES_0201-C48657-090,RES,1.1K,1%,0.05W,TK2,GENERIC; CDS_LOCATION: R28078
R30301 = RES: CDS_PHYS_PART_NAME: RES_0402-G64084-098,EMPTY,10K,1%,1/16W,LPDB,GENERIC; OriginalSymbolOrigin: (-25,75); XY: (-2725,2825); VER: 2; ROT: 0; PHYS_PAGE: 255; LOCATION: R30301; IP: GENERIC; FP_TECH: LPDB; DRAWING: @RVP1_ADL_SB_ADP_S_DDR5_SODIMM_2DPC_LIB.H55_DG2_2DPC(SCH_1):PAGE367; CDS_LIB: discrete; PCB Footprint: SMR0402IA; CHIPS_PART_NAME: RES; CDS_PART_NAME: RES_0402-G64084-098,EMPTY,10K,1%,1/16W,LPDB,GENERIC; CDS_LOCATION: R30301
R30302 = RES: CDS_PHYS_PART_NAME: RES_0402-G64084-098,CHIP,10K,1%,1/16W,LPDB,GENERIC; OriginalSymbolOrigin: (-25,75); XY: (-2725,2475); VER: 2; ROT: 0; PHYS_PAGE: 255; LOCATION: R30302; IP: GENERIC; FP_TECH: LPDB; DRAWING: @RVP1_ADL_SB_ADP_S_DDR5_SODIMM_2DPC_LIB.H55_DG2_2DPC(SCH_1):PAGE367; CDS_LIB: discrete; PCB Footprint: SMR0402IA; CHIPS_PART_NAME: RES; CDS_PART_NAME: RES_0402-G64084-098,CHIP,10K,1%,1/16W,LPDB,GENERIC; CDS_LOCATION: R30302
U10012 = C_SLG5NT1703V: CDS_PHYS_PART_NAME: C_SLG5NT1703V_LCC-K99968-001,IC,SLG5NT1703V,TK1,GENERIC; CDS_LMAN_SYM_OUTLINE: -250,300,250,-300; FP_TECH: TK1; IP: GENERIC; PACK_TYPE: LCC; ROOM: NONE; OriginalSymbolOrigin: (-275,300); XY: (275,950); VER: 1; ROT: 0; PHYS_PAGE: 255; LOCATION: U10012; DRAWING: @RVP1_ADL_SB_ADP_S_DDR5_SODIMM_2DPC_LIB.H55_DG2_2DPC(SCH_1):PAGE367; CDS_LIB: local; VARIANT: ?; PCB Footprint: CTK1_LCC16_1650X2550_400_DF2P_MA_VR; CHIPS_PART_NAME: C_SLG5NT1703V; CDS_PART_NAME: C_SLG5NT1703V_LCC-K99968-001,IC,SLG5NT1703V,TK1,GENERIC; CDS_LOCATION: U10012
U10522 = C_SLG5NT1462V: CDS_PHYS_PART_NAME: C_SLG5NT1462V_LCC-H33708-001,IC,SLG5NT1462V,TK2,GENERIC; CDS_LMAN_SYM_OUTLINE: -200,250,200,-300; FP_TECH: TK2; IP: GENERIC; PACK_TYPE: LCC; ROOM: NONE; OriginalSymbolOrigin: (-225,250); XY: (750,3400); VER: 1; ROT: 0; PHYS_PAGE: 255; LOCATION: U10522; DRAWING: @RVP1_ADL_SB_ADP_S_DDR5_SODIMM_2DPC_LIB.H55_DG2_2DPC(SCH_1):PAGE367; CDS_LIB: local; VARIANT: ?; PCB Footprint: CTK2_LCC8_1050X1650_400_MB; CHIPS_PART_NAME: C_SLG5NT1462V; CDS_PART_NAME: C_SLG5NT1462V_LCC-H33708-001,IC,SLG5NT1462V,TK2,GENERIC; CDS_LOCATION: U10522